# Altium project atmega2560_2.PrjPcb
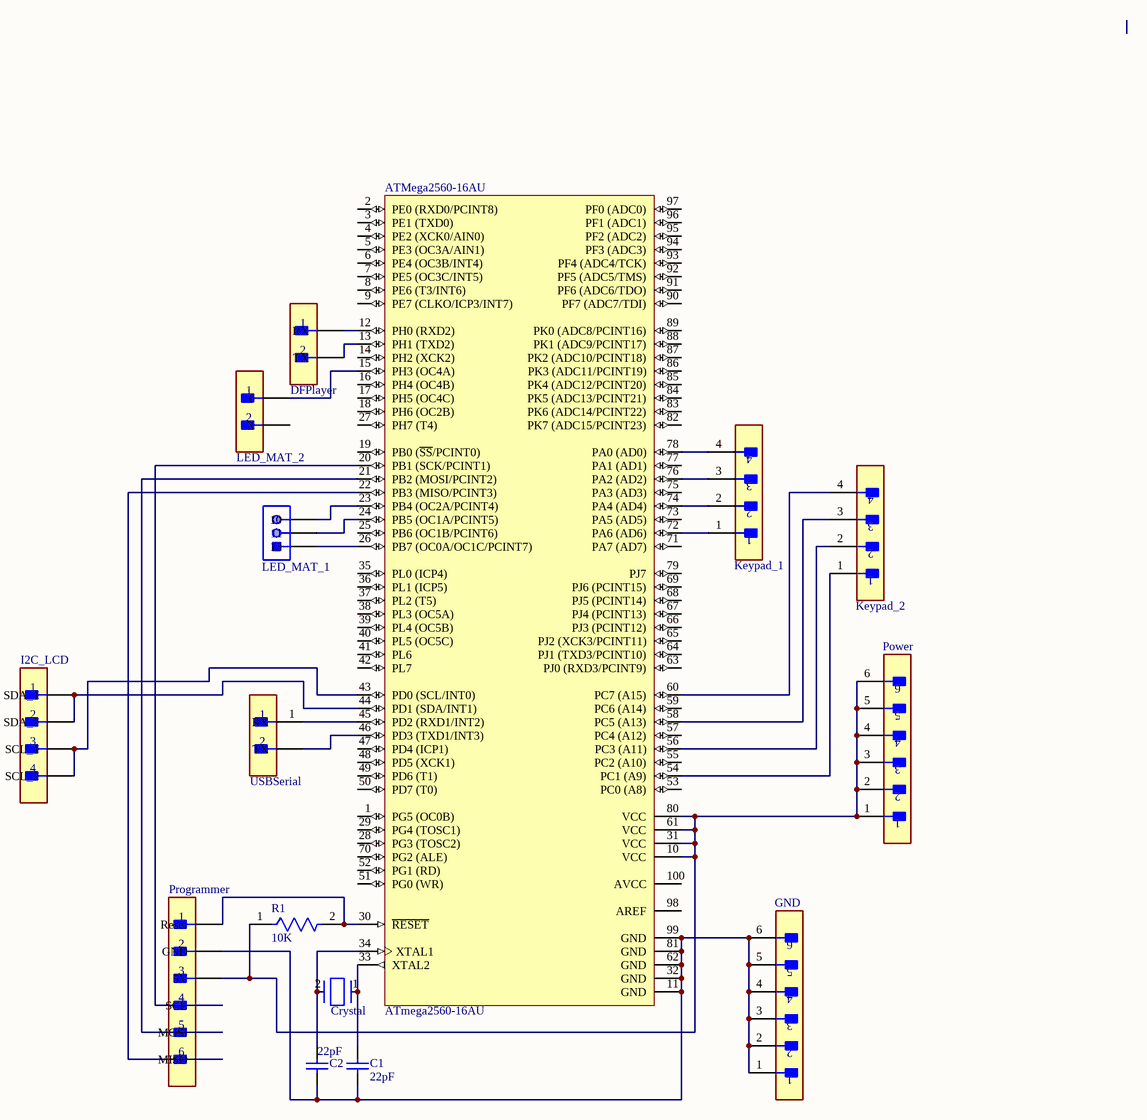
[diagram p0: atmega2560_2_sch.SchDoc]
1 sheet, 15 parts. Net scope: global (net labels, ports and power ports of the same name join across sheets).

## Sheet atmega2560_2_sch.SchDoc
size OrCAD B; SheetNumber: 1; SheetTotal: 1

### Parts
ATMega2560-16AU  ATmega2560-16AU  [100A_M]
C1  22pF  [KEMT-C315-THT-2]
C2  22pF  [KEMT-C315-THT-2]
Crystal  ABLS-16.000MHZ-K4T  [FP-ABLS-MFG]  (value not drawn)
DFPlayer  M20-9990246  [FP-M20-9990246-MFG]  (value not drawn)
GND  22-04-1061  [FP-22-04-1061-MFG]  (value not drawn)
I2C_LCD  B4B-XH-A(LF)(SN)  [FP-B4B-XH-A_LF_SN-MFG]  (value not drawn)
Keypad_1  B4B-XH-A(LF)(SN)  [FP-B4B-XH-A_LF_SN-MFG]  (value not drawn)
Keypad_2  B4B-XH-A(LF)(SN)  [FP-B4B-XH-A_LF_SN-MFG]  (value not drawn)
LED_MAT_1  B3P-VH(LF)(SN)  [JST-B3P-VH(LF)(SN)-3_V]  (value not drawn)
LED_MAT_2  M20-9990246  [FP-M20-9990246-MFG]  (value not drawn)
Power  22-04-1061  [FP-22-04-1061-MFG]  (value not drawn)
Programmer  22-29-2061  [FP-22-29-2061-MFG]  (value not drawn)
R1  10K  [FP-MBB0207-MFG]
USBSerial  M20-9990246  [FP-M20-9990246-MFG]  (value not drawn)

### Nets
NetATMega2560-16AU_10: ATMega2560-16AU.10(VCC) ATMega2560-16AU.31(VCC) ATMega2560-16AU.61(VCC) ATMega2560-16AU.80(VCC) Power.1 Power.2 Power.3 Power.4 Power.5 Power.6 Programmer.3(5V) R1.1
NetATMega2560-16AU_11: ATMega2560-16AU.11(GND) ATMega2560-16AU.32(GND) ATMega2560-16AU.62(GND) ATMega2560-16AU.81(GND) ATMega2560-16AU.99(GND) C1.1 C2.1 GND.1 GND.2 GND.3 GND.4 GND.5 GND.6 Programmer.2(GND)
NetATMega2560-16AU_12: ATMega2560-16AU.12(PH0_(RXD2)) DFPlayer.1(RX)
NetATMega2560-16AU_13: ATMega2560-16AU.13(PH1_(TXD2)) DFPlayer.2(TX)
NetATMega2560-16AU_15: ATMega2560-16AU.15(PH3_(OC4A)) LED_MAT_2.1(6)
NetATMega2560-16AU_20: ATMega2560-16AU.20(PB1_(SCK/PCINT1)) Programmer.4(SCL)
NetATMega2560-16AU_21: ATMega2560-16AU.21(PB2_(MOSI/PCINT2)) Programmer.5(MOSI)
NetATMega2560-16AU_22: ATMega2560-16AU.22(PB3_(MISO/PCINT3)) Programmer.6(MISO)
NetATMega2560-16AU_23: ATMega2560-16AU.23(PB4_(OC2A/PCINT4)) LED_MAT_1.3(10)
NetATMega2560-16AU_24: ATMega2560-16AU.24(PB5_(OC1A/PCINT5)) LED_MAT_1.2(11)
NetATMega2560-16AU_26: ATMega2560-16AU.26(PB7_(OC0A/OC1C/PCINT7)) LED_MAT_1.1(13)
NetATMega2560-16AU_30: ATMega2560-16AU.30(~{RESET}) Programmer.1(Reset) R1.2
NetATMega2560-16AU_33: ATMega2560-16AU.33(XTAL2) C1.2 Crystal.1
NetATMega2560-16AU_34: ATMega2560-16AU.34(XTAL1) C2.2 Crystal.2
NetATMega2560-16AU_43: ATMega2560-16AU.43(PD0_(SCL/INT0)) I2C_LCD.3(SCL_1) I2C_LCD.4(SCL_2)
NetATMega2560-16AU_44: ATMega2560-16AU.44(PD1_(SDA/INT1)) I2C_LCD.1(SDA_1) I2C_LCD.2(SDA_2)
NetATMega2560-16AU_45: ATMega2560-16AU.45(PD2_(RXD1/INT2)) USBSerial.1(RX)
NetATMega2560-16AU_46: ATMega2560-16AU.46(PD3_(TXD1/INT3)) USBSerial.2(TX)
NetATMega2560-16AU_54: ATMega2560-16AU.54(PC1_(A9)) Keypad_2.1
NetATMega2560-16AU_56: ATMega2560-16AU.56(PC3_(A11)) Keypad_2.2
NetATMega2560-16AU_58: ATMega2560-16AU.58(PC5_(A13)) Keypad_2.3
NetATMega2560-16AU_60: ATMega2560-16AU.60(PC7_(A15)) Keypad_2.4
NetATMega2560-16AU_72: ATMega2560-16AU.72(PA6_(AD6)) Keypad_1.1
NetATMega2560-16AU_74: ATMega2560-16AU.74(PA4_(AD4)) Keypad_1.2
NetATMega2560-16AU_76: ATMega2560-16AU.76(PA2_(AD2)) Keypad_1.3
NetATMega2560-16AU_78: ATMega2560-16AU.78(PA0_(AD0)) Keypad_1.4

Not connected (* = marked no-connect by the designer): ATMega2560-16AU 1(PG5_(OC0B)) 2(PE0_(RXD0/PCINT8)) 3(PE1_(TXD0)) 4(PE2_(XCK0/AIN0)) 5(PE3_(OC3A/AIN1)) 6(PE4_(OC3B/INT4)) 7(PE5_(OC3C/INT5)) 8(PE6_(T3/INT6)) 9(PE7_(CLKO/ICP3/INT7)) 14(PH2_(XCK2)) 16(PH4_(OC4B)) 17(PH5_(OC4C)) 18(PH6_(OC2B)) 19(PB0_(~{SS}/PCINT0)) 25(PB6_(OC1B/PCINT6)) 27(PH7_(T4)) 28(PG3_(TOSC2)) 29(PG4_(TOSC1)) 35(PL0_(ICP4)) 36(PL1_(ICP5)) 37(PL2_(T5)) 38(PL3_(OC5A)) 39(PL4_(OC5B)) 40(PL5_(OC5C)) 41(PL6) 42(PL7) 47(PD4_(ICP1)) 48(PD5_(XCK1)) 49(PD6_(T1)) 50(PD7_(T0)) 51(PG0_(WR)) 52(PG1_(RD)) 53(PC0_(A8)) 55(PC2_(A10)) 57(PC4_(A12)) 59(PC6_(A14)) 63(PJ0_(RXD3/PCINT9)) 64(PJ1_(TXD3/PCINT10)) 65(PJ2_(XCK3/PCINT11)) 66(PJ3_(PCINT12)) 67(PJ4_(PCINT13)) 68(PJ5_(PCINT14)) 69(PJ6_(PCINT15)) 70(PG2_(ALE)) 71(PA7_(AD7)) 73(PA5_(AD5)) 75(PA3_(AD3)) 77(PA1_(AD1)) 79(PJ7) 82(PK7_(ADC15/PCINT23)) 83(PK6_(ADC14/PCINT22)) 84(PK5_(ADC13/PCINT21)) 85(PK4_(ADC12/PCINT20)) 86(PK3_(ADC11/PCINT19)) 87(PK2_(ADC10/PCINT18)) 88(PK1_(ADC9/PCINT17)) 89(PK0_(ADC8/PCINT16)) 90(PF7_(ADC7/TDI)) 91(PF6_(ADC6/TDO)) 92(PF5_(ADC5/TMS)) 93(PF4_(ADC4/TCK)) 94(PF3_(ADC3)) 95(PF2_(ADC2)) 96(PF1_(ADC1)) 97(PF0_(ADC0)) 98(AREF) 100(AVCC); LED_MAT_2 2(X)

### Library data of the parts
ATMega2560-16AU = CMP-0095-00210-2: 8-bit AVR Microcontroller, 4.5-5.5V, 16MHz, 256KB Flash, 4KB EEPROM, 8KB SRAM, 86 GPIO pins, 100-pin TQFP, Industrial Grade (-40°C to 85°C), Pb-Free; PackageDescription: 100-Pin Thin Profile Plastic Quad Flat Pack (TQFP), 14 x 14 x 1.0 mm Body, 0.5 mm Pitch; ComponentLink1Description: Manufacturer URL; ComponentLink3URL: http://www.atmel.com/dyn/resources/prod_documents/2549S.pdf; RevisionNote: DatasheetVersion & PackageVersion updated. URLs added.; DatasheetVersion: revN, May-2011; ComponentLink2Description: ATmega640/1280/1281/2560/2561 Datasheet; PackageReference: 100A; PackageVersion: revD, Oct-2010; Code_JEDEC: MS-026-AED; ComponentLink1URL: http://www.atmel.com/; ComponentLink2URL: http://www.atmel.com/dyn/resources/prod_documents/doc2549.pdf; ComponentLink3Description: ATmega640/1280/1281/2560/2561 Summary
C1 C2 = CMP-1664-00008-1: Capacitor, Ceramic, 22 pF, +/-10 %, 100 V, -55 to 125 degC, 2-Pin THD, RoHS, Bulk; Max Input Voltage: 40 V; Min Input Voltage: 4.2 V; Output Current: 1.5 A; Output Voltage: 1.2 V; Outputs: 1; Case\Package: TO-220; RoHSCompliant: true; Min Operating Temperature: 0 degC; Max Operating Temperature: 125 degC; Package Quantity: 50; ComponentLink2URL: http://capacitoredge.kemet.com/capedge2/DataSheet/Datasheet-C315C220K1G5TA.pdf?pn=C315C220K1G5TA{BULK}; Radiation Hardening: No; Pins: 3; Length: 10.28 mm; ComponentLink1URL: http://www.kemet.com/; ComponentLink2Description: Datasheet; Height: 9.28 mm; REACH SVHC: No SVHC; ComponentLink1Description: Manufacturer URL; Max Ouput Current: 1.5 A; Weight: 0.08113 oz; Packaging: Rail/Tube; DatasheetVersion: Aug-16; Mount: Through Hole; PackageReference: C315-THT-2; Width: 4.82 mm; PackageDescription: 2-Pin Through Hole Device, Body 3.81 x 2.54 mm
Crystal = CMP-27762-000003-1: CRYSTAL 16.0000MHZ 18PF SMD; Manufacturer: Abracon; Frequency: 16MHz; Stability: 50ppm; Tolerance: 30ppm; Standoff Height: 0mm; Esr: 40Ω; ComponentLink2URL: https://abracon.com/Resonators/abls.pdf; Temperature Range High: +125°C; Package: ABLS; Device Class L3: Crystals; Temperature: -40°C to +125°C; Load Capacitance: 18pF; Device Class L2: Crystals / Oscillators; Mouser Description: Crystal 16MHz ±30ppm (Tol) ±50ppm (Stability) 18pF FUND 40Ohm 2-Pin HC-49/US SMD T/R; Category: Crys; ComponentLink2Description: Datasheet; Manufacturer Part Number: ABLS-16.000MHZ-K4T; Series: ABLS; Automotive: No; Octopart: https://octopart.com/abls-16.000mhz-k4t-abracon-18618626; RoHS: TRUE; Digikey Description: CRYSTAL 16.0000MHZ 18PF SMD; Temperature Range Low: -40°C; Lead Free: Yes; Height: 4.3mm; Device Class L1: Passive Components
DFPlayer LED_MAT_2 USBSerial = CMP-15831-000009-1: CONN HEADER VERT 2POS 2.54MM; Manufacturer: Harwin; Conn Gender: Male; Conn Orientation: Vertical; Number Of Contacts: 2; Current Rating: 3A; ComponentLink2URL: https://cdn.harwin.com/pdfs/M20-999.pdf; ComponentLink2Description: Datasheet; Package: M20-9990246; Temperature: -40°C to +105°C; Octopart: https://octopart.com/m20-9990246-harwin-2590635; Mouser Description: 2.54mm (0.1") Pitch SIL Vertical PC Tail Pin Header, 6.1mm mating pin height, tin, 2 contacts; Temperature Range High: +105°C; Device Class L1: Connectors; RoHS: TRUE; Automotive: No; Height: 8.99mm; Number Of Rows: 1; Contact Material: Tin,Nickel; Category: Conn; Pitch: 2.54mm; Lead Free: Yes; Digikey Description: CONN HEADER VERT 2POS 2.54MM; Manufacturer Part Number: M20-9990246; Temperature Range Low: -40°C; Device Class L3: unset; Device Class L2: Headers and Wire Housings
GND Power = CMP-04776-000934-1: CONN HEADER VERT 6POS 2.5MM; Number of Positions: 6; Contact Resistance: 20mR; Insulation Resistance: 1GR; Glow Wire Compliant: Non-compliant; Current Rating: 3A; Max Voltage Rating (DC): 250.25kV; Voltage Rating (AC): 250V; Connector Type: Male Pin; Gender: Male; Hole Diameter: 1.19mm; Termination: Solder; Number of Circuits: 6; Number of Rows: 1; Mount: Through Hole; Lead Free: Lead Free; Contact Type: Male Pin; Lead Pitch: 2.5mm; Radiation Hardening: No; Packaging: Bulk; Pitch: 2.5mm; Contact Plating: Tin; Housing Color: Natural; Fastening Type: Friction; Contact Gender: Male; Length: 14.5mm; Orientation: Straight; Series: KK® 5045; Number of Contacts: 6; Halogen Free: Low Halogen; Min Operating Temperature: -40°C; Number of Poles: 6; Width: 5.8mm; Housing Material: Nylon; Max Operating Temperature: 105°C; Contact Material: Brass; Flammability Rating: UL94 V-0; Color: Natural; Contact Mating Length: 0.295inch; Working Voltage: 250V; Voltage Rating: 250V; Package Quantity: 1; Height: 11.7mm; Voltage Rating (DC): 250V
I2C_LCD Keypad_1 Keypad_2 = CMP-17439-000250-1: CONN HEADER VERT 4POS 2.5MM; Number of Contacts: 4; Contact Resistance: 20mR; Voltage Rating: 250V; Max Current Rating: 3A; Gender: Male; Wire/Cable Gauge: 22AWG; Mated Stacking Heights: 9.8mm; Insulation Resistance: 1GR; Orientation: Straight; Contact Type: Male Pin; Contact Finish - Mating: TIN; Series: XH; Max Voltage Rating (AC): 250V; Lead Pitch: 2.5mm; Contact Shape: Square; Insulation Color: Natural; Termination: Solder; Lead Free: Lead Free; Voltage Rating (AC): 250V; Number of Rows: 1; Flammability Rating: UL94 V-0; Number of Positions: 4; Max Operating Temperature: 85°C; Package Quantity: 500; Mount: Through Hole; REACH SVHC: No SVHC; Connector Type: Header; Insulation Material: Nylon; Fastening Type: Detent; Min Operating Temperature: -25°C; Housing Color: White; Packaging: Bulk; Contact Plating: Tin; Contact Material: Brass; Max Voltage Rating (DC): 250V; Housing Material: Polyamide; Color: Natural; Material: Polyamide; Pitch: 2.5mm; Depth: 5.75mm; Current Rating: 3A; Length: 12.4mm
LED_MAT_1 = CMP-1755-00003-1: Male Header, Pitch 3.96 mm, 1 x 3 Position, Height 10.9 mm, Tail Length 3.7 mm, -25 to 85 degC, RoHS, Bulk; PackageReference: B3P-VH(LF)(SN); ComponentLink2Description: Datasheet; ComponentLink2URL: http://www.jst-mfg.com/product/pdf/eng/eVH.pdf; DatasheetVersion: May-16; PackageDescription: Male Header, Pitch 3.96 mm, 1 x 3 Position, Height 10.9 mm, Tail Length 3.7 mm; ComponentLink1URL: http://www.jst.com/home2.html; ComponentLink1Description: Manufacturer URL
Programmer = CMP-04776-000348-1: CONN HEADER VERT 6POS 2.54MM; Gender: Male; Number of Poles: 6; Voltage Rating: 250V; Insulation Resistance: 50GR; Contact Resistance: 10mR; Current Rating: 4A; Number of Lines: 1; Height: 11.7mm; Mount: Through Hole; Length: 15.24mm; Contact Plating: Gold; Contact Type: Male Pin; Contact Material: Brass; Housing Material: Nylon; Series: KK® 6410; Number of Positions: 6; Contact Mating Length: 0.295inch; Fastening Type: Friction; RoHS Compliant: Yes; Color: Natural; Max Operating Temperature: 75°C; Contact Gender: Male; Packaging: Bulk; Termination: Solder; Voltage Rating (DC): 250V; Orientation: Straight; Radiation Hardening: No; Flammability Rating: UL94 V-0; Package Quantity: 1000; Housing Color: White; Number of Rows: 1; Min Operating Temperature: 0°C; Max Current Rating: 4A; Pitch: 2.54mm; Depth: 5.8mm; Number of Contacts: 6; Lead Free: Lead Free
R1 = CMP-02408-000035-1: RES 10K OHM 0.6W 1% AXIAL; Voltage Rating: 300V; Resistance: 10kR; Max Power Dissipation: 600mW; Temperature Coefficient: 50ppm/°C; Radiation Hardening: No; Case/Package: Conformal; Termination: Axial; Military Standard: Not; Length: 6.5mm; Voltage Rating (DC): 300V; RoHS Compliant: Yes; Number of Terminations: 2; Packaging: Tape and Reel; Features: Automotive AEC-Q200; Tolerance: 1%; Min Operating Temperature: -55°C; Power Rating: 600mW; Lead Free: Lead Free; Resistor Type: Metal Film; Construction: Cylindrical; Series: MBB 0207 - Professional; Max Operating Temperature: 155°C; Diameter: 2.5mm; Resistance Tolerance: 1%; Contact Plating: Tin; Technology: THIN FILM